# EAGLE design vcsklpf (EAGLE 7.7.0)
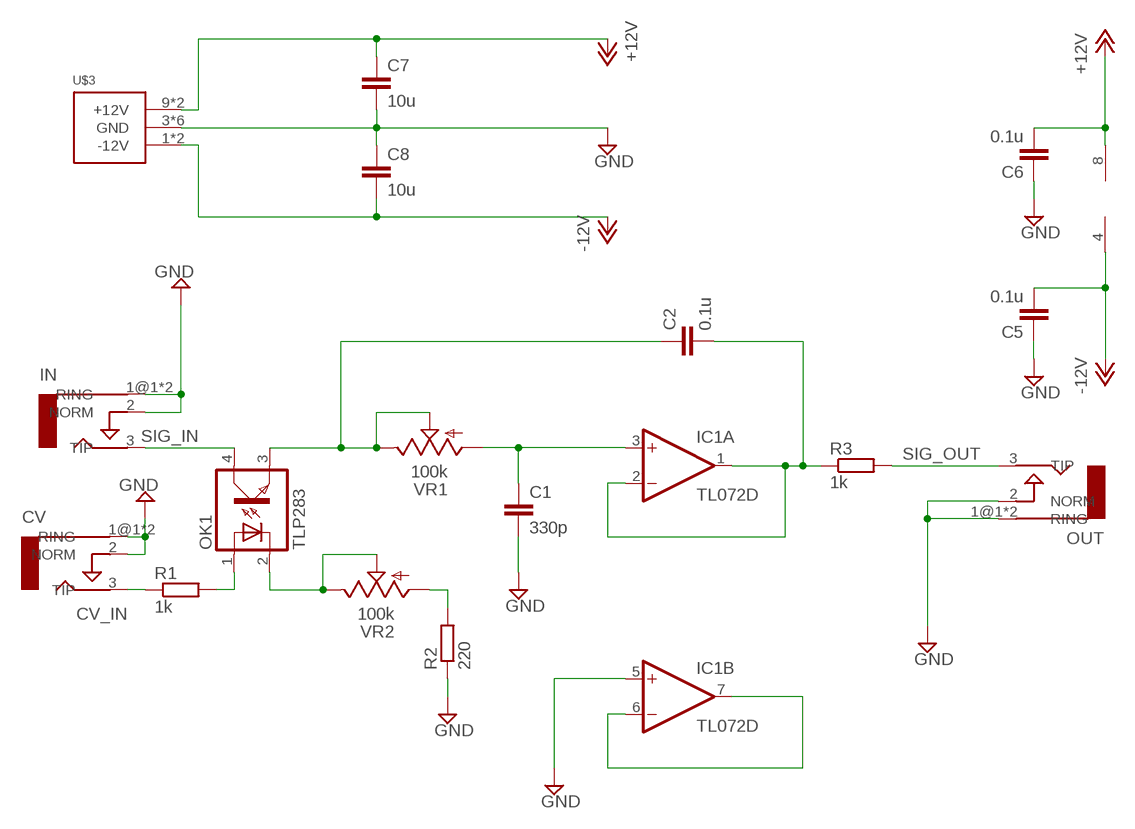
[diagram p0: schematic, sheet 1]

## Parts
C1  330p  C-EUC0805  [C0805]
C2  0.1u  C-EUC0805  [C0805]
C5  0.1u  C-EUC0805  [C0805]
C6  0.1u  C-EUC0805  [C0805]
C7  10u  C-EUC0805  [C0805]
C8  10u  C-EUC0805  [C0805]
CV  AUDIO-JACKERTHENVAR  [ERTHENVAR-JACK]
IC1  TL072D  [SO08]
IN  AUDIO-JACKERTHENVAR  [ERTHENVAR-JACK]
OK1  TLP283  [MINI-FLAT-4]
OUT  AUDIO-JACKERTHENVAR  [ERTHENVAR-JACK]
R1  1k  R-EU_R0805  [R0805]
R2  220  R-EU_R0805  [R0805]
R3  1k  R-EU_R0805  [R0805]
U$3  POWER_SIMPLE10  [POWER_10]
VR1  100k  9MM_SNAP-IN_POT_  [9MM_SNAP-IN_POT]
VR2  100k  9MM_SNAP-IN_POT_  [9MM_SNAP-IN_POT]

## Nets
+12V: C6.2 C7.1 IC1.8(P:V+) U$3.9(+12V) U$3.10(+12V)
-12V: C5.2 C8.2 IC1.4(P:V-) U$3.1(-12V) U$3.2(-12V)
CV_IN: CV.3(TIP) R1.1
GND: C1.2 C5.1 C6.1 C7.2 C8.1 CV.1@1(RING) CV.1@2(RING) CV.2(NORM) IC1.5(B:+IN) IN.1@1(RING) IN.1@2(RING) IN.2(NORM) OUT.1@1(RING) OUT.1@2(RING) OUT.2(NORM) R2.1 U$3.3(GND) U$3.4(GND) U$3.5(GND) U$3.6(GND) U$3.7(GND) U$3.8(GND)
N$1: C2.2 IC1.1(A:OUT) IC1.2(A:-IN) R3.1
N$2: C1.1 IC1.3(A:+IN) VR1.1(A)
N$3: C2.1 OK1.3(EMIT) VR1.2(S) VR1.3(E)
N$5: IC1.6(B:-IN) IC1.7(B:OUT)
N$7: OK1.2(C) VR2.2(S) VR2.3(E)
N$8: OK1.1(A) R1.2
N$12: R2.2 VR2.1(A)
SIG_IN: IN.3(TIP) OK1.4(COL)
SIG_OUT: OUT.3(TIP) R3.2

## Library data of the parts
C1 C2 C5-C8 = rcl:C-EU: CAPACITOR, European symbol
CV IN OUT = erthenvar:AUDIO-JACK: Switching Mono 3.5mm Audio Jack from Erthenvar.
IC1 = linear:TL072: OP AMP
OK1 = optocoupler:TLP283: TOSHIBA PHOTOCOUPLER GaAs IRED & PHOTO-TRANSISTOR Source: http://www.semicon.toshiba.co.jp/td/en/Opto/Photocoupler/en_20050928_TLP283_datasheet.pdf; OC_FARNELL: unknown; OC_NEWARK: unknown
R1-R3 = rcl:R-EU_: RESISTOR, European symbol
U$3 = eurorack:POWER_SIMPLE
VR1 VR2 = MusicThingModular:9MM_SNAP-IN_POT: 9mm vertical snap-in pot, Alpha / Panasonic style

## Board
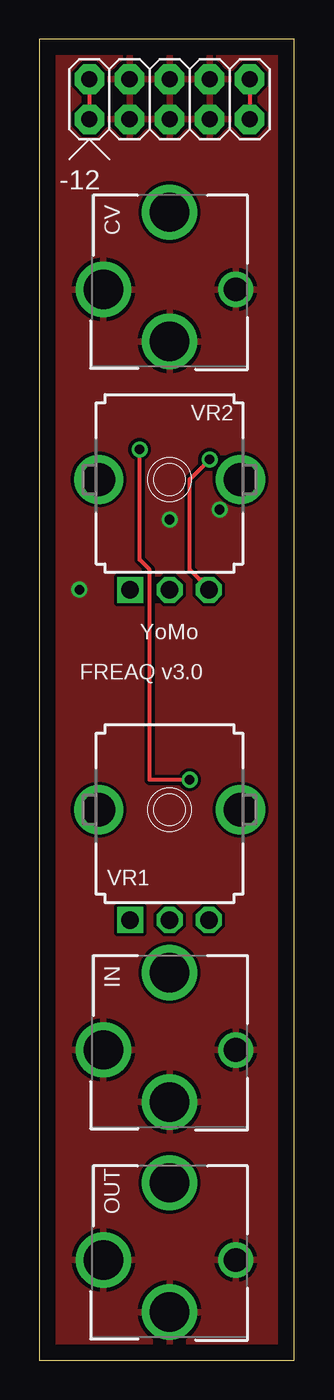
[diagram p1: board, top side]
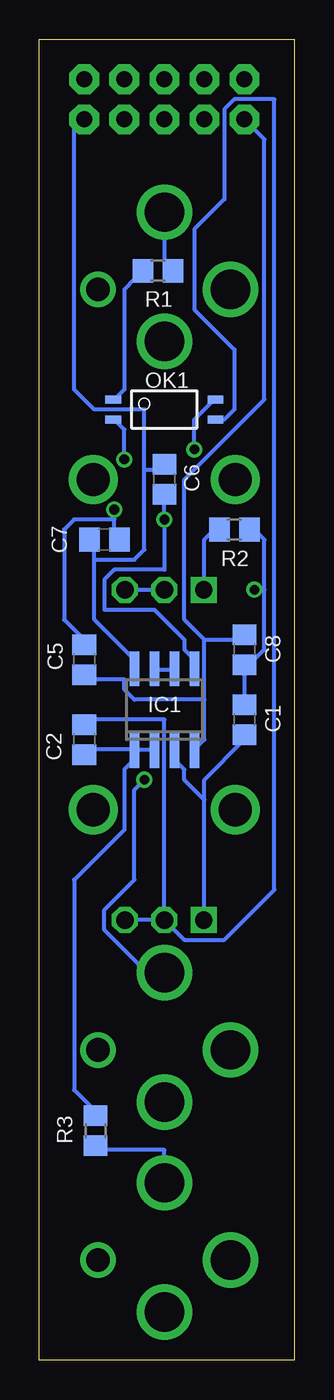
[diagram p2: board, bottom side, seen from below]

Size 16.18 x 83.81 mm. Coordinates in mm from the lower left corner, seen from the top.
Outline: 0,0 16.18,0 16.18,83.81 0,83.81 0,0
Copper layers (1*16): Top 0.035mm / dielectric 1.5mm / Bottom 0.035mm
Design rules "default": minimum track width 10mil, minimum drill 24mil, track to track 8mil, track to pad 8mil, pad to pad 8mil, via to via 8mil, smd to smd 8mil, copper to edge 40mil, drill to drill 8mil, minimum pad ring 10mil, minimum via ring 8mil, stop-mask expansion 4mil, vias tented up to drill 0mil, thermal gap 10mil

### Footprints (pad centres in the part's own frame; a part is rotated, then mirrored left to right if it is on the bottom)
C0805 = smd 1.3 x 1.5: 1 -0.95,0; 2 0.95,0
ERTHENVAR-JACK = drill 2.5: 1@1 -4.2,0; 2 0,-3.3; 3 0,4.9 | drill 1.5: 1@2 4.2,0
SO08 = smd 0.6 x 2.2: 1 -1.905,-2.6; 2 -0.635,-2.6; 3 0.635,-2.6; 4 1.905,-2.6; 5 1.905,2.6; 6 0.635,2.6; 7 -0.635,2.6; 8 -1.905,2.6
MINI-FLAT-4 = smd 1 x 0.5: 1 -3.24,0.635; 2 -3.24,-0.635; 3 3.24,-0.635; 4 3.24,0.635
R0805 = smd 1.3 x 1.5: 1 -0.95,0; 2 0.95,0
POWER_10 = drill 1.016 pad 1.88 octagon: 1 -5.08,-1.27; 2 -5.08,1.27; 3 -2.54,-1.27; 4 -2.54,1.27; 5 0,-1.27; 6 0,1.27; 7 2.54,-1.27; 8 2.54,1.27; 9 5.08,-1.27; 10 5.08,1.27
9MM_SNAP-IN_POT = drill 1.1 square: 1 -2.5,-7 | drill 1.1 octagon: 2 0,-7; 3 2.5,-7 | drill 2.1 pad 2.794: CHASSIS1 -4.5,0; CHASSIS2 4.5,0

### Placement (x,y rotation side)
C1  3.17,40.64 90 bottom
C2  13.34,39.37 270 bottom
C5  13.34,44.45 270 bottom
C6  8.26,55.88 90 bottom
C7  12.06,52.07 0 bottom
C8  3.17,45.09 90 bottom
CV  8.26,67.94 0 top
IC1  8.26,41.27 0 bottom
IN  8.26,19.68 0 top
OK1  8.26,60.33 0 bottom
OUT  8.26,6.35 0 top
R1  8.66,69.13 180 bottom
R2  3.81,52.7 180 bottom
R3  12.62,14.56 270 bottom
U$3  8.26,80.01 0 top
VR1  8.26,34.92 0 top
VR2  8.26,55.88 0 top

### Tracks (layer width: path | path; a pad name or v marks a point on that pad's centre or on a via)
+12V
  Top 0.254: U$3.10 U$3.9
  Bottom 0.254: 12.7,50.8 12.7,46.99 10.16,44.45 IC1.8 | 12.7,50.8 12.7,52.07 C7.1 | 9.53,56.52 8.26,56.52 C6.2 | 9.53,56.52 9.53,51.44 10.16,50.8 12.7,50.8 | U$3.9 13.97,78.11 13.97,61.59 12.7,60.33 9.53,60.33 9.53,56.52
-12V
  Top 0.254: U$3.2 U$3.1
  Bottom 0.254: 5.71,45.72 3.17,45.72 C8.2 | 5.71,41.91 5.71,39.37 6.35,38.73 IC1.4 | 5.71,41.91 5.71,45.72 | 5.71,41.91 10.16,41.91 10.79,42.55 10.79,43.18 13.34,43.18 C5.2 | U$3.1 1.91,77.47 1.91,60.96 6.99,55.88 6.99,46.99 5.71,45.72
CV_IN
  Bottom 0.254: CV.3 8.26,69.22 R1.1
GND  (via drill 0.61)
  Bottom 0.254: 3.17,43.81 C1.2 | 1.91,48.9 1.91,45.09 3.17,43.81 | 1.91,48.9 1.91,52.07 2.54,52.7 R2.1 | 3.17,43.81 C8.1 | C6.1 v8.26,53.34 8.26,50.16 11.43,50.16 12.06,49.53 12.06,47.62 8.89,47.62 6.99,45.72 6.99,45.09 6.35,44.45 IC1.5 | 11.43,53.34 13.97,53.34 14.61,52.7 14.61,46.99 13.34,45.72 C5.1 | 11.43,53.34 11.43,52.07 C7.2 | 11.43,53.34 v11.43,53.98 | v2.54,48.9 1.91,48.9
  pour Top: 0,83.82 16.51,83.82 16.51,0 0,0
N$1
  Bottom 0.254: R3.1 12.7,15.88 13.97,17.14 13.97,30.48 10.79,33.66 10.79,37.47 10.16,38.1 IC1.1 10.16,38.73 | 10.16,38.73 13.34,38.73 C2.2 | 10.16,38.73 8.89,38.73 IC1.2
N$2
  Bottom 0.254: 5.71,35.56 5.71,27.94 VR1.1 | 5.71,35.56 5.71,36.83 3.17,39.37 C1.1 | 5.71,35.56 6.99,36.83 6.99,37.47 7.62,38.1 IC1.3
N$3
  Bottom 0.254: 8.26,27.94 6.99,26.67 4.45,26.67 1.27,29.84 1.27,80.01 3.81,80.01 4.45,79.38 4.45,73.66 6.35,71.75 6.35,66.67 3.81,64.14 3.81,60.33 4.45,59.69 OK1.3 5.08,59.69 | 8.26,27.94 8.26,40.64 13.34,40.64 C2.1 | 8.26,27.94 10.16,27.94 VR1.3 | 8.26,27.94 VR1.2
N$5
  Bottom 0.254: IC1.6 7.62,43.81 8.89,43.81 IC1.7
N$7  (via drill 0.61)
  Top 0.254: v10.79,57.15 9.53,55.88 9.53,50.16 10.16,49.53 10.79,49.53 10.79,48.9 VR2.3
  Bottom 0.254: v10.79,57.15 10.79,59.05 11.43,59.69 OK1.2 | VR2.2 8.26,48.9 10.16,48.9 VR2.3
N$8
  Bottom 0.254: OK1.1 11.43,60.96 10.79,61.59 10.79,67.94 10.16,68.58 R1.2
N$12
  Bottom 0.254: R2.2 5.08,52.7 5.71,52.07 5.71,48.9 VR2.1
SIG_IN  (via drill 0.61)
  Top 0.254: v6.35,57.78 6.35,50.8 6.99,50.16 6.99,36.83 v9.53,36.83
  Bottom 0.254: v6.35,57.78 6.35,59.69 5.08,60.96 OK1.4 | v9.53,36.83 10.16,36.2 10.16,30.48 12.06,28.57 12.06,27.3 9.53,24.77 8.26,24.77 IN.3
SIG_OUT
  Bottom 0.254: OUT.3 8.26,13.34 12.06,13.34 R3.2

### Text on the board
tNames: YoMo | FREAQ v3.0